# EAGLE design Catch The Light Game (EAGLE 9.6.2)
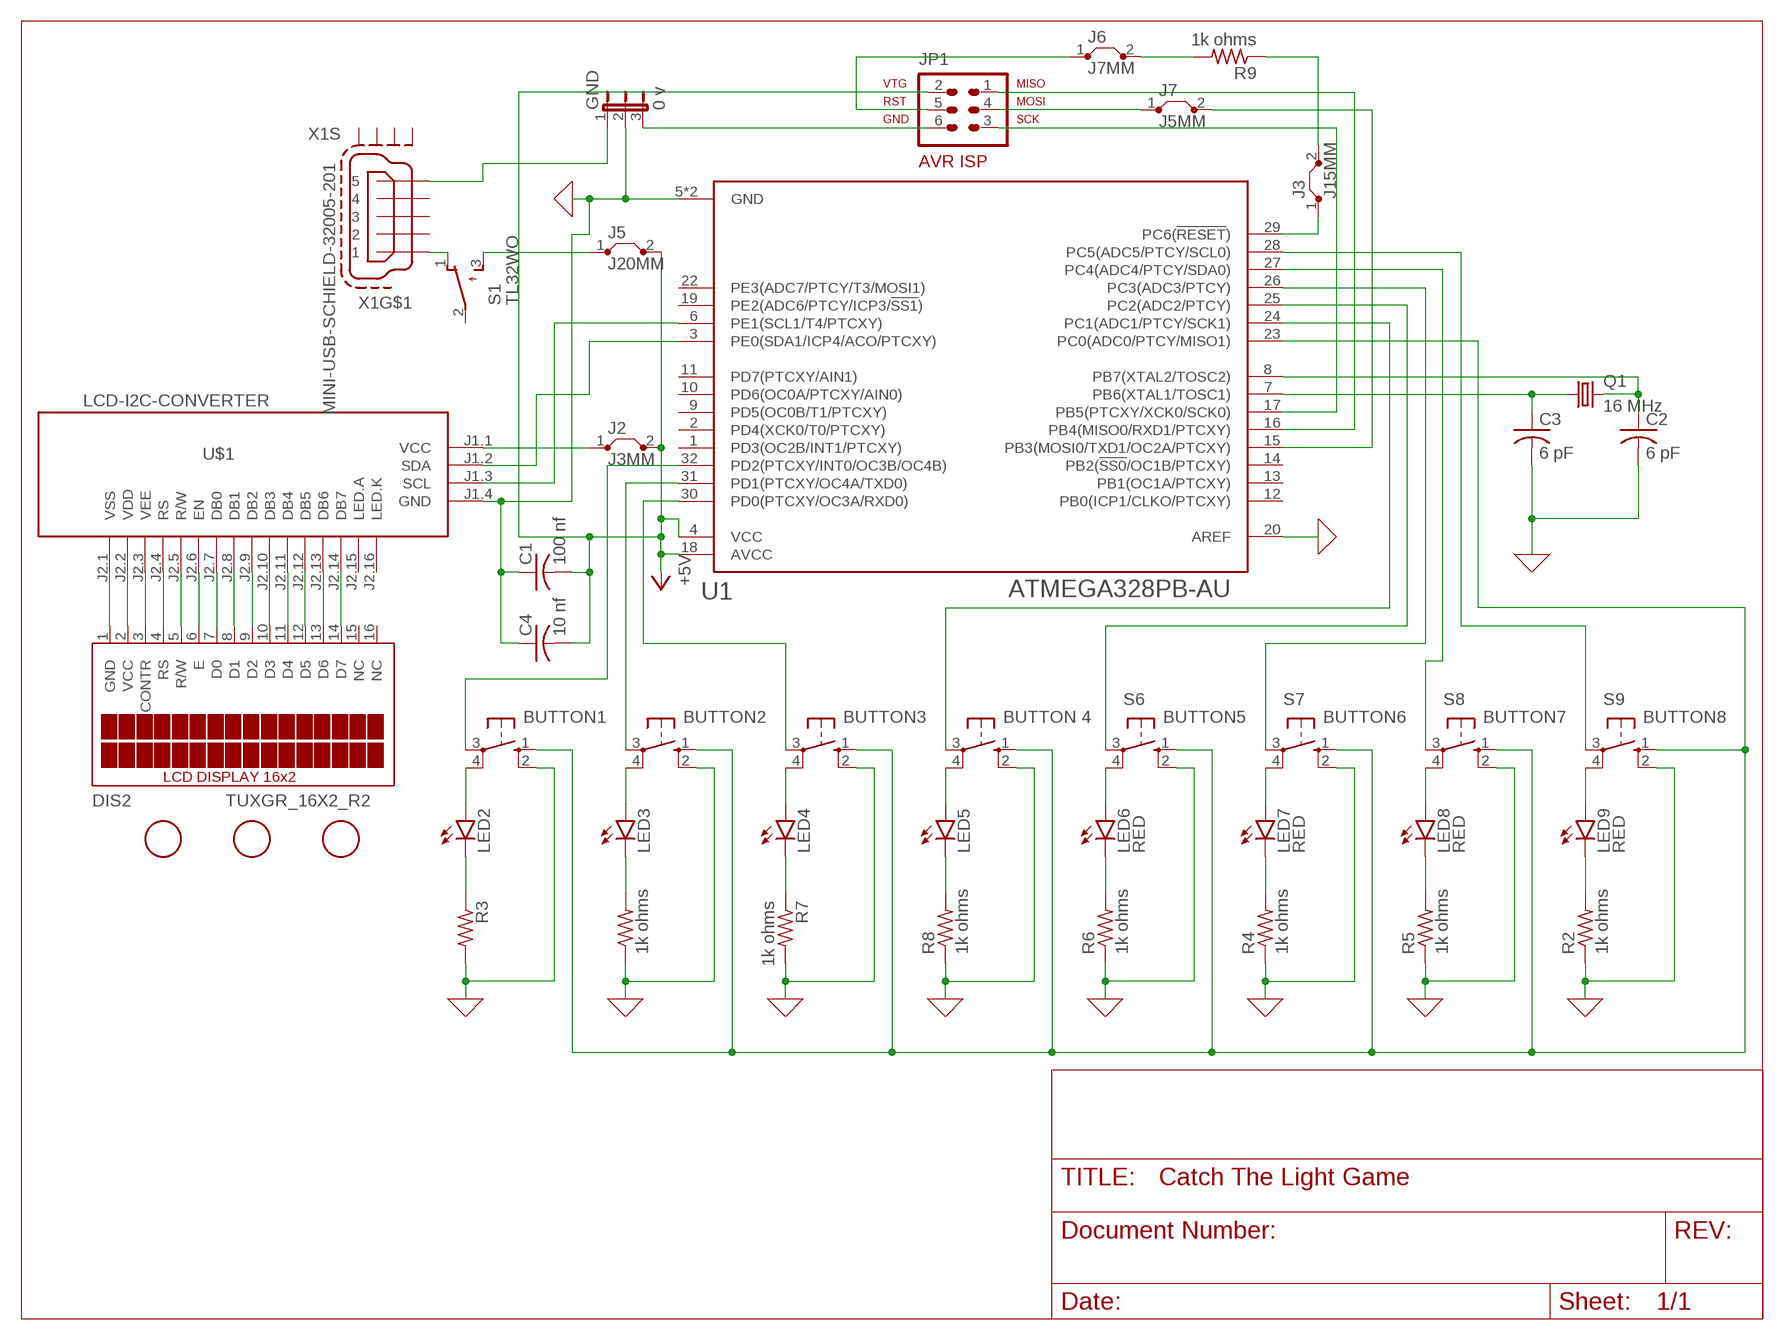
[diagram p0: schematic, sheet 1]

## Parts
C1  100 nf  C-US025-024X044  [C025-024X044]
C2  6 pF  C-US025-024X044  [C025-024X044]
C3  6 pF  C-US025-024X044  [C025-024X044]
C4  10 nf  C-US025-024X044  [C025-024X044]
DIS2  TUXGR_16X2_R2  [TUXGR_16X2_R2]
GND  0 v  JP2E  [JP2]
J2  J3MM  [03]
J3  J15MM  [15]
J5  J20MM  [20]
J6  J7MM  [07]
J7  J5MM  [05]
JP1  AVR-ISP-6R  [AVR-ISP-6R]
LED2  RED  LED5MM  [LED5MM]
LED3  RED  LED5MM  [LED5MM]
LED4  RED  LED5MM  [LED5MM]
LED5  RED  LED5MM  [LED5MM]
LED6  RED  LED5MM  [LED5MM]
LED7  RED  LED5MM  [LED5MM]
LED8  RED  LED5MM  [LED5MM]
LED9  RED  LED5MM  [LED5MM]
Q1  16 MHz  CRYSTALHC49S  [HC49/S]
R1  1k ohms  R-US_0204/5  [0204/5]
R2  1k ohms  R-US_0204/5  [0204/5]
R3  1K ohms  R-US_0204/5  [0204/5]
R4  1k ohms  R-US_0204/5  [0204/5]
R5  1k ohms  R-US_0204/5  [0204/5]
R6  1k ohms  R-US_0204/5  [0204/5]
R7  1k ohms  R-US_0204/5  [0204/5]
R8  1k ohms  R-US_0204/5  [0204/5]
R9  1k ohms  R-US_0204/5  [0204/5]
S1  TL32WO  [TL3XWO]
S2  BUTTON1  10-XX  [B3F-10XX]
S3  BUTTON2  10-XX  [B3F-10XX]
S4  BUTTON3  10-XX  [B3F-10XX]
S5  BUTTON 4  10-XX  [B3F-10XX]
S6  BUTTON5  10-XX  [B3F-10XX]
S7  BUTTON6  10-XX  [B3F-10XX]
S8  BUTTON7  10-XX  [B3F-10XX]
S9  BUTTON8  10-XX  [B3F-10XX]
U1  ATMEGA328PB-AU  [QFP80P900X900X120-32N]
U$1  LCD-I2C-CONVERTER  [LCD-I2C-CONVERTER]
U$2  FIDUCIAL  [FIDUCIAL_1MM]
U$3  FIDUCIAL  [FIDUCIAL_1MM]
U$4  FIDUCIAL  [FIDUCIAL_1MM]
X1  MINI-USB-SCHIELD-32005-201  [32005-201]

## Nets
0: C1.1 C2.2 C3.2 C4.1 GND.2 R1.1 R2.1 R3.2 R4.1 R5.1 R6.1 R7.2 R8.1 S2.2(S1) S3.2(S1) S4.2(S1) S5.2(S1) S6.2(S1) S7.2(S1) S8.2(S1) S9.2(S1) U1.5(GND) U1.20(AREF) U1.21(GND) U$1.J1.4(GND) ; supply symbol labelled GND
N$1: DIS2.7(D0) U$1.J2.7(DB0)
N$2: DIS2.8(D1) U$1.J2.8(DB1)
N$3: DIS2.9(D2) U$1.J2.9(DB2)
N$4: DIS2.10(D3) U$1.J2.10(DB3)
N$5: DIS2.11(D4) U$1.J2.11(DB4)
N$6: DIS2.12(D5) U$1.J2.12(DB5)
N$7: DIS2.13(D6) U$1.J2.13(DB6)
N$8: JP1.3 U1.17(PB5(PTCXY/XCK0/SCK0))
N$9: LED3.K(C) R1.2
N$10: LED3.A S3.4(P1)
N$11: S8.3(P) U1.27(PC4(ADC4/PTCY/SDA0))
N$12: S4.3(P) U1.30(PD0(PTCXY/OC3A/RXD0))
N$13: LED4.A S4.4(P1)
N$14: J7.2 U1.15(PB3(MOSI0/TXD1/OC2A/PTCXY))
N$15: LED8.A S8.4(P1)
N$16: LED7.K(C) R4.2
N$18: LED9.A S9.4(P1)
N$19: LED6.A S6.4(P1)
N$21: S5.3(P) U1.24(PC1(ADC1/PTCY/SCK1))
N$23: S6.3(P) U1.25(PC2(ADC2/PTCY))
N$24: S7.3(P) U1.26(PC3(ADC3/PTCY))
N$25: DIS2.14(D7) U$1.J2.14(DB7)
N$26: DIS2.4(RS) U$1.J2.4(RS)
N$27: GND.1 X1.5
N$28: DIS2.5(R/W) U$1.J2.5(R/W)
N$29: DIS2.6(E) U$1.J2.6(EN)
N$30: S9.3(P) U1.28(PC5(ADC5/PTCY/SCL0))
N$31: S3.3(P) U1.31(PD1(PTCXY/OC4A/TXD0))
N$32: JP1.1 U1.16(PB4(MISO0/RXD1/PTCXY))
N$33: J2.1 U$1.J1.1(VCC)
N$34: DIS2.1(GND) U$1.J2.1(VSS)
N$35: DIS2.2(VCC) U$1.J2.2(VDD)
N$36: DIS2.3(CONTR) U$1.J2.3(VEE)
N$37: U1.3(PE0(SDA1/ICP4/ACO/PTCXY)) U$1.J1.2(SDA)
N$40: S2.1(S) S3.1(S) S4.1(S) S5.1(S) S6.1(S) S7.1(S) S8.1(S) S9.1(S) U1.23(PC0(ADC0/PTCY/MISO1))
N$41: LED5.A S5.4(P1)
N$44: LED4.K(C) R7.1
N$45: S1.1(O) X1.1
N$46: J6.1 JP1.5
N$47: U1.6(PE1(SCL1/T4/PTCXY)) U$1.J1.3(SCL)
N$48: J6.2 R9.2
N$50: C2.1 Q1.2 U1.8(PB7(XTAL2/TOSC2))
N$51: C3.1 Q1.1 U1.7(PB6(XTAL1/TOSC1))
N$52: J3.1 U1.29(PC6(!RESET!))
N$53: GND.3 JP1.6
N$54: J7.1 JP1.4
N$55: LED5.K(C) R8.2
N$56: J5.1 S1.3(S)
N$57: LED2.K(C) R3.1
N$58: J3.2 R9.1
N$59: S2.3(P) U1.32(PD2(PTCXY/INT0/OC3B/OC4B))
N$60: LED6.K(C) R6.2
N$65: LED7.A S7.4(P1)
N$66: LED8.K(C) R5.2
N$67: LED9.K(C) R2.2
N$181: LED2.A S2.4(P1)
VCC: C1.2 C4.2 J2.2 J5.2 JP1.2 U1.4(VCC) U1.18(AVCC) ; supply symbol labelled +5V
Unconnected: DIS2.15(NC) DIS2.16(NC) S1.2(P) U1.1(PD3(OC2B/INT1/PTCXY)) U1.2(PD4(XCK0/T0/PTCXY)) U1.9(PD5(OC0B/T1/PTCXY)) U1.10(PD6(OC0A/PTCXY/AIN0)) U1.11(PD7(PTCXY/AIN1)) U1.12(PB0(ICP1/CLKO/PTCXY)) U1.13(PB1(OC1A/PTCXY)) U1.14(PB2(!SS0!/OC1B/PTCXY)) U1.19(PE2(ADC6/PTCY/ICP3/!SS1!)) U1.22(PE3(ADC7/PTCY/T3/MOSI1)) U$1.J2.15(LED.A) U$1.J2.16(LED.K) X1.2 X1.3 X1.4 X1.M1(S:S1) X1.M2(S:S2) X1.M3(S:S3) X1.M4(S:S4)

## Library data of the parts
C1-C4 = rcl:C-US: CAPACITOR, American symbol; SPICEPREFIX: C
DIS2 = display-lcd:TUXGR_16X2_R2: Tuxgraphics LCD display 16x2 characters reflective, without background light Source: tuxgr_12x2_r2.pdf; OC_FARNELL: unknown; OC_NEWARK: unknown; SPICEPREFIX: X
GND = jumper:JP2E: JUMPER
J2 J3 J5-J7 = jumper:J: Bridge
JP1 = atmel:AVR-ISP-6: AVR ISP-6 Serial Programming Header
LED2-LED9 = led:LED: LED OSRAM: - CHIPLED LG R971, LG N971, LY N971, LG Q971, LY Q971, LO R971, LY R971 LH N974, LH R974 LS Q976, LO Q976, LY Q976 LO Q996 - Hyper CHIPLED LW Q18S LB Q993, LB Q99A, LB R99A - SideLED LS A670, LO A670, LY A670, LG A670, LP A670 LB A673, LV A673, LT A673, LW A673 LH A674 LY A675 LS A676, LA A676, LO A676, LY A676, LW A676 LS A679, LY A679, LG A679 - Hyper Micro SIDELED® LS Y876, LA Y876, LO Y876, LY Y876 LT Y87S - SmartLED LW L88C, LW L88S LB L89C, LB L89S, LG L890 LS L89K, LO L89K, LY L89K LS L896, LA L896, LO L896, LY L896 - TOPLED LS T670, LO T670, LY T670, LG T670, LP T670 LSG T670, LSP T670, LSY T670, LOP T670, LYG T670 LG T671, LOG T671, LSG T671 LB T673, LV T673, LT T673, LW T673 LH T674 LS T676, LA T676, LO T676, LY T676, LB T676, LH T676, LSB T676, LW T676 LB T67C, LV T67C, LT T67C, LS T67K, LO T67K, LY T67K, LW E67C LS E67B, LA E67B, LO E67B, LY E67B, LB E67C, LV E67C, LT E67C LW T67C LS T679, LY T679, LG T679 LS T770, LO T770, LY T770, LG T770, LP T770 LB T773, LV T773, LT T773, LW T773 LH T774 LS E675, LA E675, LY E675, LS T675 LS T776, LA T776, LO T776, LY T776, LB T776 LHGB T686 LT T68C, LB T68C - Hyper Mini TOPLED® LB M676 - Mini TOPLED Santana® LG M470 LS M47K, LO M47K, LY M47K Source: http://www.osram.convergy.de LUXEON: - LUMILED® LXK2-PW12-R00, LXK2-PW12-S00, LXK2-PW14-U00, LXK2-PW14-V00 LXK2-PM12-R00, LXK2-PM12-S00, LXK2-PM14-U00 LXK2-PE12-Q00, LXK2-PE12-R00, LXK2-PE12-S00, LXK2-PE14-T00, LXK2-PE14-U00 LXK2-PB12-K00, LXK2-PB12-L00, LXK2-PB12-M00, LXK2-PB14-N00, LXK2-PB14-P00, LXK2-PB14-Q00 LXK2-PR12-L00, LXK2-PR12-M00, LXK2-PR14-Q00, LXK2-PR14-R00 LXK2-PD12-Q00, LXK2-PD12-R00, LXK2-PD12-S00 LXK2-PH12-R00, LXK2-PH12-S00 LXK2-PL12-P00, LXK2-PL12-Q00, LXK2-PL12-R00 Source: www.luxeon.com KINGBRIGHT: KA-3528ASYC Source: www.kingbright.com
Q1 = crystal:CRYSTAL: CRYSTAL; OC_FARNELL: 1667008; OC_NEWARK: unknown
R1-R9 = rcl:R-US_: RESISTOR, American symbol; SPICEPREFIX: R
S1 = switch:TL32WO: TINY SWITCH ON - MOM Source: http://www2.produktinfo.conrad.com/datenblaetter/700000-724999/705152-da-01-de-Subminiaturschalter_TL_36WO.pdf
S2-S9 = switch-omron:10-XX: OMRON SWITCH; MPN: B3F-1000; OC_FARNELL: 176432; OC_NEWARK: 36M3542
U1 = ATMEGA328PB-AU:ATMEGA328PB-AU: ATmega Series 20 MHz 32 KB Flash 2 KB SRAM 8-Bit Microcontroller - TQFP-32 Check prices <https://pricing.snapeda.com/search/part/ATMEGA328PB-AU/?ref=eda>; AVAILABILITY: Good; DESCRIPTION: AVR AVR® ATmega Microcontroller IC 8-Bit 20MHz 32KB (16K x 16) FLASH 32-TQFP (7x7); MF: Microchip Technology; MP: ATMEGA328PB-AU; PACKAGE: TQFP-32 Microchip Technology; PRICE: None; PURCHASE-URL: https://pricing.snapeda.com/search/part/ATMEGA328PB-AU/?ref=eda
U$1 = diy-modules:LCD-I2C-CONVERTER: I2C Bus to 4-Bit Parallel LCD Interface with LED backlight driver; SPICEPREFIX: X
U$2-U$4 = ECE388 (2):FIDUCIAL: For use by pick and place machines to calibrate the vision/machine, 1mm By microbuilder.eu
X1 = con-cypressindustries:MINI-USB-SCHIELD-: MINI USB-B Conector Source: www.cypressindustries.com; OC_FARNELL: unknown; OC_NEWARK: unknown

## Board
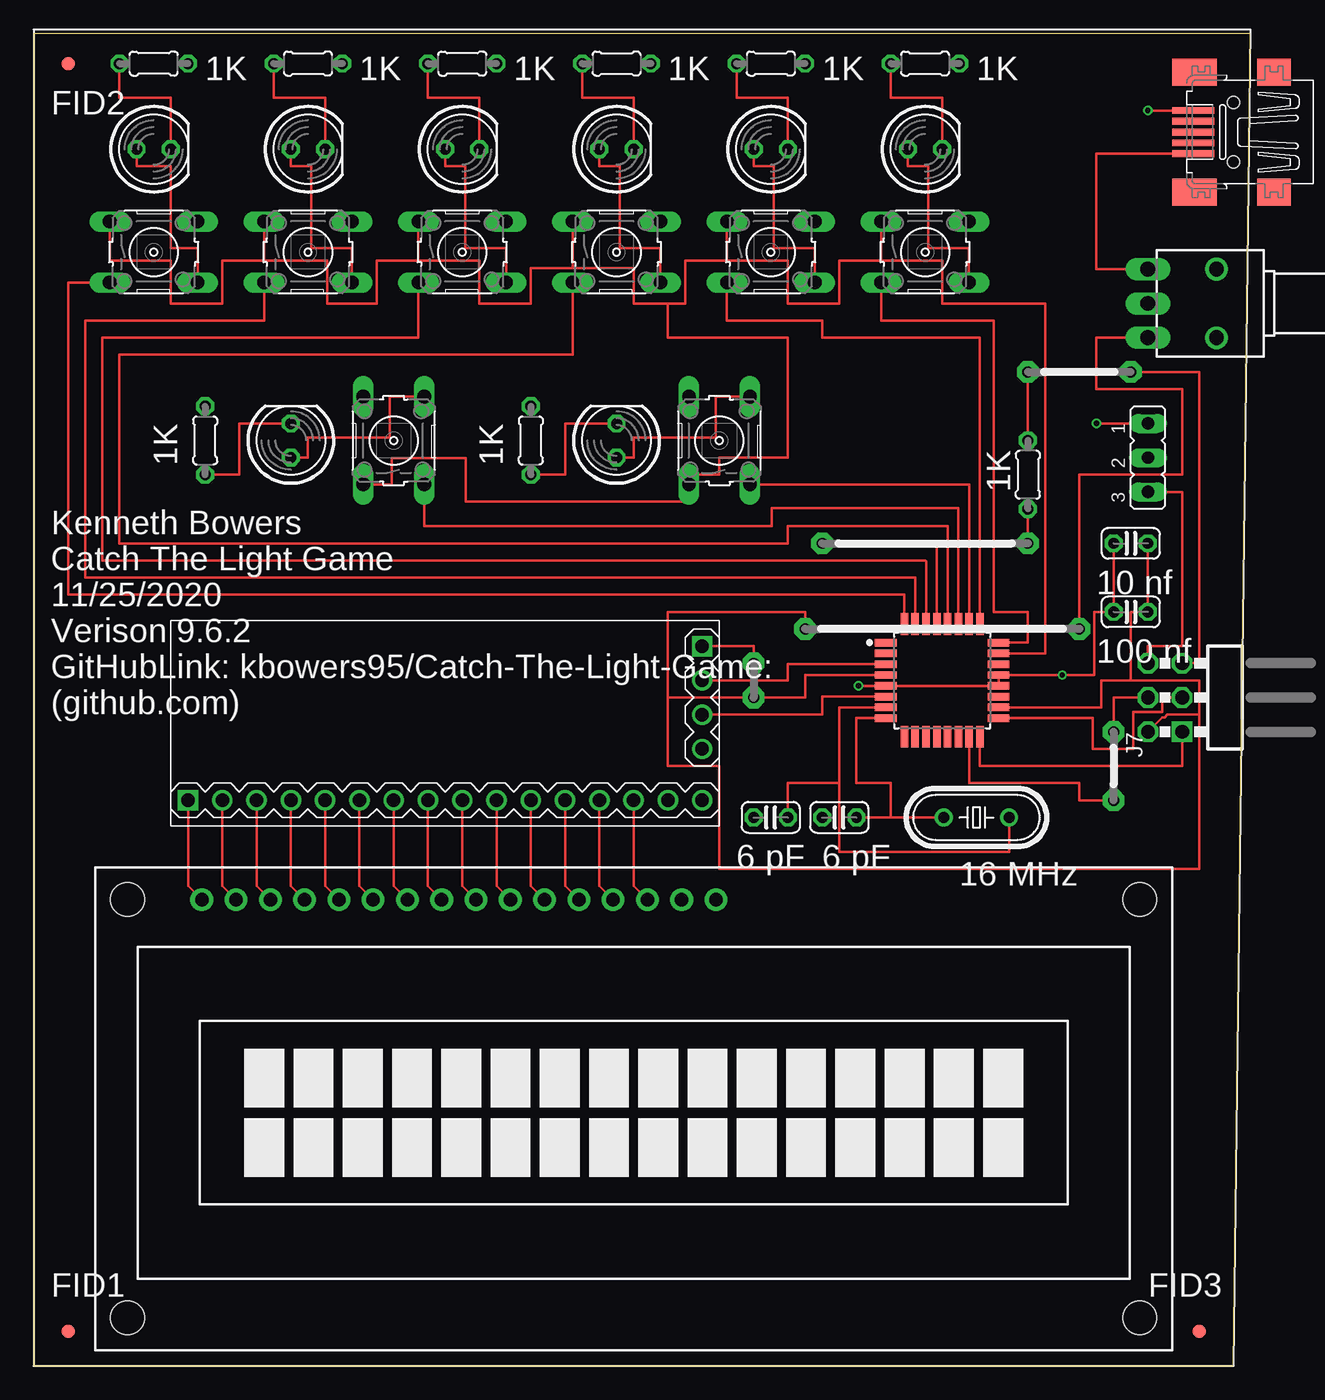
[diagram p1: board, top side]
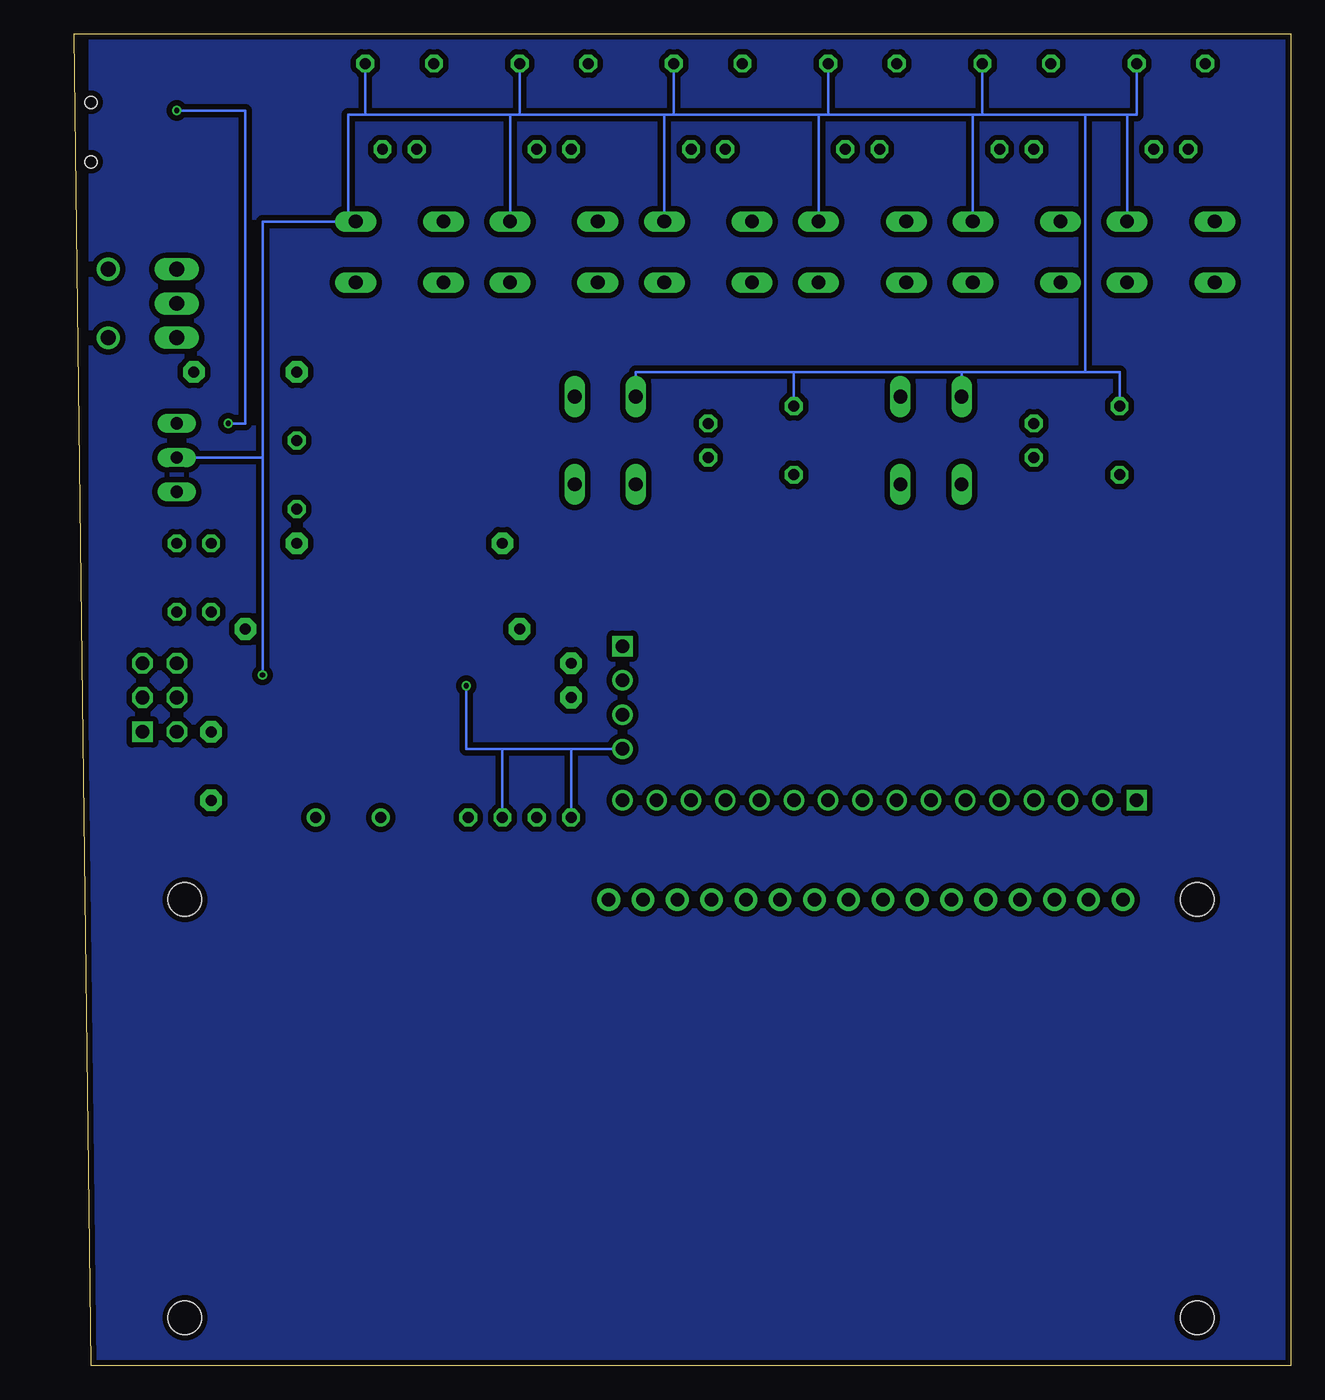
[diagram p2: board, bottom side, seen from below]

Size 90.15 x 98.73 mm. Coordinates in mm from the lower left corner, seen from the top.
Outline: 0,0 88.88,0 90.15,98.73 0,98.73 0,0
Copper layers (1*16): Top 0.035mm / dielectric 1.5mm / Bottom 0.035mm
Design rules "Dirty8TS": minimum track width 8mil, minimum drill 15mil, track to track 8mil, track to pad 8mil, pad to pad 8mil, via to via 8mil, smd to smd 0mil, copper to edge 10mil, drill to drill 10mil, minimum pad ring 10mil, minimum via ring 6mil, stop-mask expansion 2mil, vias tented up to drill 25mil, thermal gap 10mil

### Footprints (pad centres in the part's own frame; a part is rotated, then mirrored left to right if it is on the bottom)
C025-024X044 = drill 0.813 octagon: 1 -1.27,0; 2 1.27,0
TUXGR_16X2_R2 = drill 1 pad 1.676: 1 -32,15.5; 2 -29.46,15.5; 3 -26.92,15.5; 4 -24.38,15.5; 5 -21.84,15.5; 6 -19.3,15.5; 7 -16.76,15.5; 8 -14.22,15.5; 9 -11.68,15.5; 10 -9.14,15.5; 11 -6.6,15.5; 12 -4.06,15.5; 13 -1.52,15.5; 14 1.02,15.5; 15 3.56,15.5; 16 6.1,15.5 | hole 2.5: -37.5,-15.5; 37.5,-15.5; -37.5,15.5; 37.5,15.5
JP2 = drill 0.914 long: 1 -2.54,0; 2 0,0; 3 2.54,0
03 = drill 0.813 pad 1.6 octagon: 1 0,0; 2 2.54,0
15 = drill 0.813 pad 1.6 octagon: 1 -7.62,0; 2 7.62,0
20 = drill 0.813 pad 1.6 octagon: 1 -10.16,0; 2 10.16,0
07 = drill 0.813 pad 1.6 octagon: 1 -3.81,0; 2 3.81,0
05 = drill 0.813 pad 1.6 octagon: 1 -2.54,0; 2 2.54,0
AVR-ISP-6R = drill 1.016 square: 1 -2.54,-1.27 | drill 1.016 octagon: 2 -2.54,1.27; 3 0,-1.27; 4 0,1.27; 5 2.54,-1.27; 6 2.54,1.27
LED5MM = drill 0.813 octagon: A -1.27,0; K 1.27,0
HC49/S = drill 0.813: 1 -2.413,0; 2 2.413,0
0204/5 = drill 0.813 octagon: 1 -2.54,0; 2 2.54,0
TL3XWO = drill 1.1 pad 1.422 long: 1 -2.54,-5.08; 2 0,-5.08; 3 2.54,-5.08 | drill 1.1 pad 1.676: M1 -2.54,0; M2 2.54,0
B3F-10XX = drill 1.016 long: 1 -3.251,2.261; 2 3.251,2.261; 3 -3.251,-2.261; 4 3.251,-2.261
QFP80P900X900X120-32N = smd 1.6 x 0.55: 1 -4.18,2.8; 2 -4.18,2; 3 -4.18,1.2; 4 -4.18,0.4; 5 -4.18,-0.4; 6 -4.18,-1.2; 7 -4.18,-2; 8 -4.18,-2.8; 17 4.18,-2.8; 18 4.18,-2; 19 4.18,-1.2; 20 4.18,-0.4; 21 4.18,0.4; 22 4.18,1.2; 23 4.18,2; 24 4.18,2.8 | smd 0.55 x 1.6: 9 -2.8,-4.18; 10 -2,-4.18; 11 -1.2,-4.18; 12 -0.4,-4.18; 13 0.4,-4.18; 14 1.2,-4.18; 15 2,-4.18; 16 2.8,-4.18; 25 2.8,4.18; 26 2,4.18; 27 1.2,4.18; 28 0.4,4.18; 29 -0.4,4.18; 30 -1.2,4.18; 31 -2,4.18; 32 -2.8,4.18
LCD-I2C-CONVERTER = drill 1 square: J1.1 -19.05,-5.08; J2.1 19.05,6.35 | drill 1: J1.2 -19.05,-2.54; J1.3 -19.05,0; J1.4 -19.05,2.54; J2.2 16.51,6.35; J2.3 13.97,6.35; J2.4 11.43,6.35; J2.5 8.89,6.35; J2.6 6.35,6.35; J2.7 3.81,6.35; J2.8 1.27,6.35; J2.9 -1.27,6.35; J2.10 -3.81,6.35; J2.11 -6.35,6.35; J2.12 -8.89,6.35; J2.13 -11.43,6.35; J2.14 -13.97,6.35; J2.15 -16.51,6.35; J2.16 -19.05,6.35
FIDUCIAL_1MM = smd 1 x 1: 1 0,0
32005-201 = smd 3.1 x 0.5: 1 3,1.6; 2 3,0.8; 3 3,0; 4 3,-0.8; 5 3,-1.6 | smd 2.5 x 2: M1 -3,-4.45; M2 -3,4.45 | smd 3.3 x 2: M3 2.9,4.45; M4 2.9,-4.45 | hole 0.9: 0,2.2; 0,-2.2

### Placement (x,y rotation side)
C1  81.28,55.88 0 top
C2  59.69,40.64 180 top
C3  54.61,40.64 180 top
C4  81.28,60.96 0 top
DIS2  44.45,19.05 0 top
GND  82.55,67.31 270 top
J2  53.34,52.07 270 top
J3  66.04,60.96 0 top
J5  67.31,54.61 180 top
J6  77.47,73.66 180 top
J7  80.01,44.45 270 top
JP1  83.82,49.53 90 top
LED2  8.89,90.17 0 top
LED3  20.32,90.17 0 top
LED4  31.75,90.17 0 top
LED5  66.04,90.17 0 top
LED6  54.61,90.17 0 top
LED7  43.18,68.58 90 top
LED8  19.05,68.58 90 top
LED9  43.18,90.17 0 top
Q1  69.85,40.64 180 top
R1  20.32,96.52 180 top
R2  43.18,96.52 180 top
R3  8.89,96.52 0 top
R4  36.83,68.58 270 top
R5  12.7,68.58 270 top
R6  54.61,96.52 180 top
R7  31.75,96.52 0 top
R8  66.04,96.52 180 top
R9  73.66,66.04 90 top
S1  87.63,78.74 270 top
S2  8.89,82.55 0 top
S3  20.32,82.55 0 top
S4  31.75,82.55 0 top
S5  66.04,82.55 0 top
S6  54.61,82.55 0 top
S7  50.8,68.58 90 top
S8  26.67,68.58 90 top
S9  43.18,82.55 0 top
U1  67.31,50.8 0 top
U$1  30.48,48.26 180 top
U$2  2.54,2.54 0 top
U$3  86.36,2.54 0 top
U$4  2.54,96.52 0 top
X1  88.9,91.44 180 top

### Tracks (layer width: path | path; a pad name or v marks a point on that pad's centre or on a via)
0  (via drill 0.38)
  Top 0.203: v61.11,50.4 U1.5 U1.20 U1.21 v76.2,51.2 78.58,51.2 78.58,55.88 C1.1 C4.1
  Bottom 0.203: R3.2 11.43,92.71 12.14,92.71 | 12.14,92.71 15.24,92.71 | 15.24,92.71 22.86,92.71 | 22.86,92.71 R1.1 | 22.86,92.71 23.57,92.71 | 23.57,92.71 34.29,92.71 | R7.2 34.29,92.71 | 34.29,92.71 35,92.71 | 35,92.71 45.72,92.71 | 45.72,92.71 R2.1 | 45.72,92.71 46.43,92.71 | 46.43,92.71 57.15,92.71 | 57.15,92.71 R6.1 | 24.41,73.66 36.83,73.66 | 15.24,92.71 15.24,73.66 | 57.15,92.71 57.86,92.71 | 57.86,92.71 68.58,92.71 | R8.1 68.58,92.71 | 68.58,92.71 69.85,92.71 69.85,84.81 S5.2 76.2,84.81 76.2,67.31 | 76.2,67.31 v76.2,51.2 | GND.2 76.2,67.31 | v61.11,50.4 61.11,45.72 58.42,45.72 | U$1.J1.4 53.34,45.72 | 53.34,45.72 58.42,45.72 | C3.2 53.34,45.72 | 58.42,45.72 C2.2 | S7.2 48.54,73.66 36.83,73.66 | S8.2 24.41,73.66 | 15.24,73.66 12.7,73.66 R5.1 | 15.24,73.66 24.41,73.66 | S3.2 23.57,92.71 | S2.2 12.14,92.71 | S4.2 35,92.71 | S9.2 46.43,92.71 | S6.2 57.86,92.71 | 36.83,73.66 R4.1
GND
  pour Bottom (isolate 0.406): 0,99.06 88.9,99.06 88.9,0 0,0
N$1
  Top 0.203: U$1.J2.7 26.67,35.57 DIS2.7
N$2
  Top 0.203: U$1.J2.8 29.21,35.57 DIS2.8
N$3
  Top 0.203: DIS2.9 31.75,35.57 U$1.J2.9
N$4
  Top 0.203: U$1.J2.10 34.29,35.57 DIS2.10
N$5
  Top 0.203: U$1.J2.11 36.83,35.57 DIS2.11
N$6
  Top 0.203: U$1.J2.12 39.37,35.57 DIS2.12
N$7
  Top 0.203: DIS2.13 41.91,35.57 U$1.J2.13
N$8
  Top 0.203: JP1.3 83.62,49.53 83.62,48.46 81.48,48.46 81.48,45.72 78.48,45.72 78.48,48 U1.17
N$9
  Top 0.203: R1.2 17.78,93.98 21.59,93.98 LED3.K
N$10
  Top 0.203: LED3.A 19.05,88.9 20.55,88.9 20.55,82.83 23.57,82.83 S3.4
N$11
  Top 0.203: U1.27 68.51,63.58 54.69,63.58 54.69,62.23 28.93,62.23 S8.3
N$12
  Top 0.203: U1.30 66.11,59.62 66.04,59.69 5.08,59.69 5.08,76.2 28.5,76.2 S4.3
N$13
  Top 0.203: LED4.A 30.48,88.9 31.98,88.9 31.98,82.83 35,82.83 S4.4
N$14
  Top 0.203: U1.15 69.31,43.18 77.47,43.18 77.47,41.91 J7.2
N$15
  Top 0.203: LED8.A 20.32,67.31 20.32,68.81 26.39,68.81 26.39,71.83 S8.4
N$16
  Top 0.203: LED7.K 39.37,69.85 39.37,66.04 R4.2
N$18
  Top 0.203: LED9.A 41.91,88.9 43.41,88.9 43.41,82.83 46.43,82.83 S9.4
N$19
  Top 0.203: S6.4 57.86,82.83 54.84,82.83 54.84,88.9 53.34,88.9 LED6.A
N$21
  Top 0.203: U1.24 73.66,53.6 73.66,55.88 71.12,55.88 71.12,77.47 62.79,77.47 S5.3
N$23
  Top 0.203: U1.25 70.11,76.2 58.42,76.2 58.42,77.47 51.36,77.47 S6.3
N$24
  Top 0.203: U1.26 69.31,65.33 S7.3
N$25
  Top 0.203: U$1.J2.14 44.45,35.57 DIS2.14
N$26
  Top 0.203: U$1.J2.4 19.05,35.57 DIS2.4
N$27  (via drill 0.38)
  Top 0.203: X1.5 v82.55,93.04 | GND.1 v78.74,69.85
  Bottom 0.203: v78.74,69.85 77.47,69.85 77.47,93.04 v82.55,93.04
N$28
  Top 0.203: U$1.J2.5 21.59,35.57 DIS2.5
N$29
  Top 0.203: U$1.J2.6 24.13,35.57 DIS2.6
N$30
  Top 0.203: U1.28 67.71,62.23 55.88,62.23 55.88,60.96 6.35,60.96 6.35,74.93 39.93,74.93 S9.3
N$31
  Top 0.203: U1.31 65.31,58.42 3.81,58.42 3.81,77.47 17.07,77.47 S3.3
N$32
  Top 0.203: JP1.1 85.09,44.45 70.11,44.45 U1.16
N$33
  Top 0.203: U$1.J1.1 53.34,53.34 J2.1
N$34
  Top 0.203: U$1.J2.1 11.43,35.57 DIS2.1
N$35
  Top 0.203: U$1.J2.2 13.97,35.57 DIS2.2
N$36
  Top 0.203: U$1.J2.3 16.51,35.57 DIS2.3
N$37
  Top 0.203: U$1.J1.2 55.88,50.8 55.88,52 U1.3
N$40
  Top 0.203: U1.23 74.93,52.8 74.93,78.74 67.31,78.74 67.31,81.92 62.79,81.92 | 46.99,78.74 48.26,78.74 48.26,81.92 51.36,81.92 | 46.99,78.74 44.45,78.74 44.45,81.36 39.93,81.36 | S4.1 28.5,81.92 | S2.1 5.64,81.92 10.16,81.92 10.16,78.74 13.97,78.74 13.97,81.92 17.07,81.92 | S3.1 17.07,81.92 | 17.07,81.92 21.73,81.92 21.73,78.74 25.4,78.74 25.4,81.92 28.5,81.92 | 51.36,81.92 S6.1 | 51.36,81.92 55.88,81.92 55.88,78.74 59.69,78.74 59.69,81.92 62.79,81.92 | 28.5,81.92 33.02,81.92 33.02,78.74 36.83,78.74 36.83,81.36 39.93,81.36 | 62.79,81.92 S5.1 | S8.1 26.54,65.33 26.54,67.26 32,67.26 32,64.06 48.54,64.06 S7.1 48.54,66.04 50.8,66.04 50.8,67.31 55.88,67.31 55.88,76.2 46.99,76.2 46.99,78.74 | S9.1 39.93,81.36
N$41
  Top 0.203: S5.4 69.29,82.83 66.27,82.83 66.27,88.9 64.77,88.9 LED5.A
N$44
  Top 0.203: R7.1 29.21,93.98 33.02,93.98 LED4.K
N$45
  Top 0.203: S1.1 78.74,81.28 78.74,89.84 X1.1
N$46
  Top 0.203: JP1.5 86.36,52.07 86.36,73.66 J6.1
N$47
  Top 0.203: U$1.J1.3 58.42,48.26 58.42,49.6 U1.6
N$48
  Top 0.203: J6.2 R9.2
N$50
  Top 0.203: U1.8 60.96,48 60.96,43.18 63.5,43.18 63.5,40.64 | 63.5,40.64 C2.1 | 63.5,40.64 Q1.2
N$51
  Top 0.203: U1.7 59.69,48.8 59.69,43.18 | C3.1 55.88,43.18 59.69,43.18 | Q1.1 72.26,38.1 59.69,38.1 59.69,43.18
N$52
  Top 0.203: J3.1 66.91,60.96 U1.29
N$53
  Top 0.203: GND.3 85.09,64.77 85.09,53.34 82.55,53.34 JP1.6
N$54
  Top 0.203: JP1.4 80.01,49.53 J7.1
N$55
  Top 0.203: R8.2 63.5,93.98 67.31,93.98 LED5.K
N$56
  Top 0.203: S1.3 78.74,76.2 78.74,72.39 85.09,72.39 85.09,66.04 77.47,66.04 J5.1
N$57
  Top 0.203: R3.1 6.35,93.98 10.16,93.98 LED2.K
N$58
  Top 0.203: R9.1 J3.2
N$59
  Top 0.203: U1.32 64.51,57.15 2.54,57.15 2.54,80.29 S2.3
N$60
  Top 0.203: R6.2 52.07,93.98 55.88,93.98 LED6.K
N$65
  Top 0.203: LED7.A 44.45,67.31 44.45,68.81 50.52,68.81 50.52,71.83 S7.4
N$66
  Top 0.203: LED8.K 15.24,69.85 15.24,66.04 R5.2
N$67
  Top 0.203: R2.2 40.64,93.98 44.45,93.98 LED9.K
N$181
  Top 0.203: LED2.A 7.62,88.9 10.16,88.9 10.16,82.83 12.14,82.83 S2.4
VCC
  Top 0.203: U1.4 57.15,51.2 57.15,49.53 J2.2 46.99,49.53 | 46.99,49.53 46.99,44.45 50.8,44.45 50.8,36.83 86.36,36.83 86.36,48.26 | 86.36,48.26 86.36,50.8 81.28,50.8 | J5.2 57.15,55.88 46.99,55.88 46.99,49.53 | U1.18 79.11,48.8 79.11,50.8 81.28,50.8 | C4.2 C1.2 81.28,55.88 81.28,50.8 | JP1.2 83.62,48.06 83.78,48.06 83.99,48.26 86.36,48.26

### Text on the board
tPlace: 1K | 1K | 1K | 1K | 1K | 1K | FID2 | 1K | 1K | 1K | 10 nf | 100 nf | Kenneth Bowers / Catch The Light Game / 11/25/2020 / Verison 9.6.2 / GitHubLink: kbowers95/Catch-The-Light-Game: / (github.com) | 6 pF | 6 pF | 16 MHz | FID1 | FID3